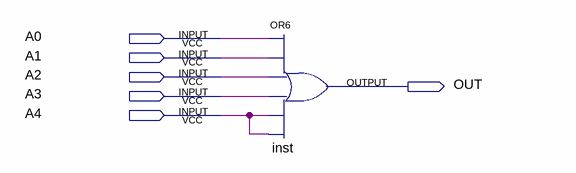
[diagram p0: schematic sheet]
// Quartus schematic eh_zero2.bdf as structural Verilog: 1 symbols, 6 pins
module eh_zero2 (
  input  A0,
  input  A1,
  input  A2,
  input  A3,
  input  A4,
  output OUT
);

  or inst (OUT, A0, A1, A2, A3, A4, A4);
endmodule
